# EAGLE design powerbutton (EAGLE 7.1.0)
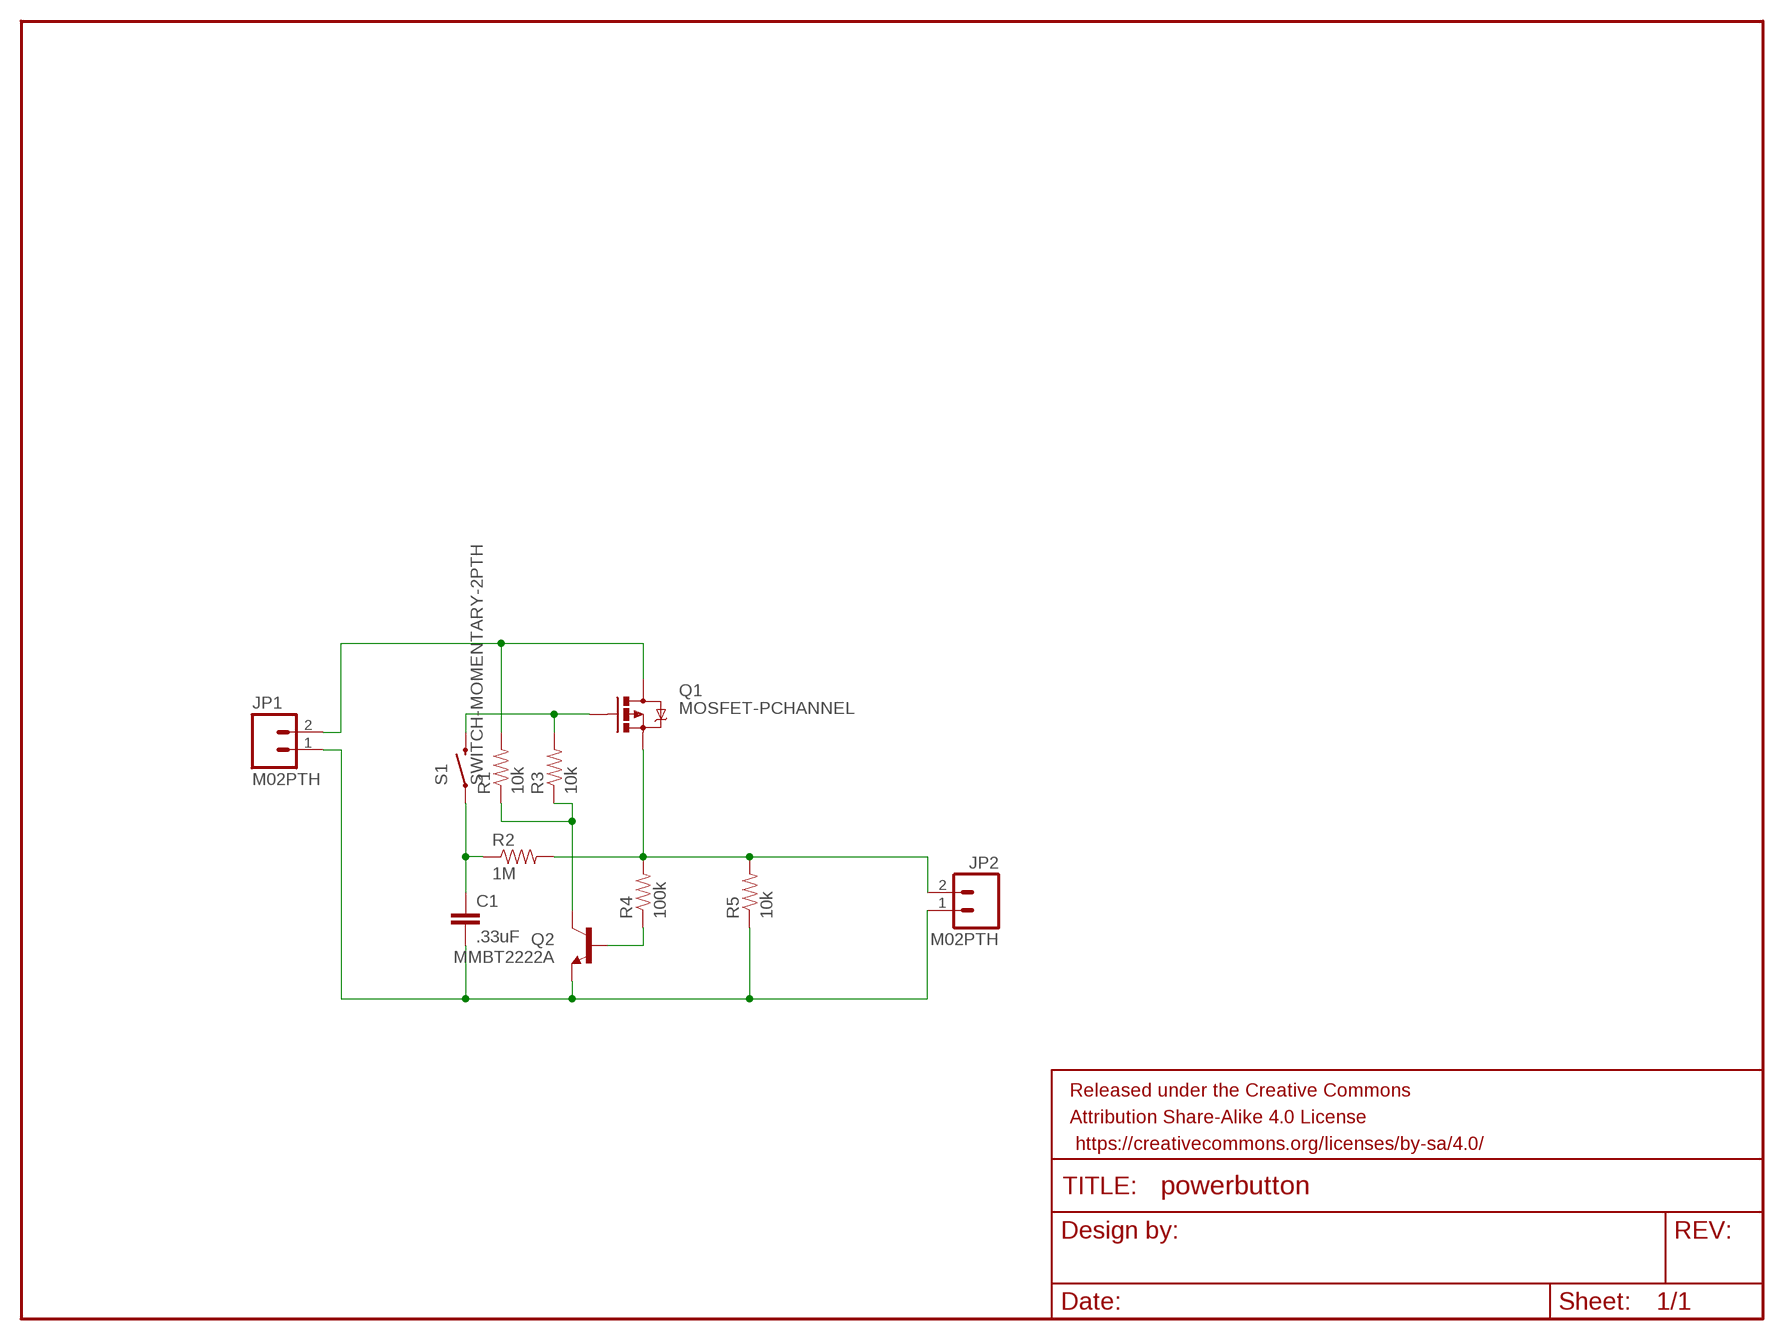
[diagram p0: schematic, sheet 1]

## Parts
C1  .33uF  CAP0603-CAP  [0603-CAP]
FRAME1  FRAME-LETTER  [CREATIVE_COMMONS]
JP1  M02PTH  [1X02]
JP2  M02PTH  [1X02]
Q1  MOSFET-PCHANNEL  [SOT23-3]
Q2  MMBT2222A  TRANSISTOR_NPNMMBT2222A  [SOT23-3]
R1  10k  RESISTOR0603-RES  [0603-RES]
R2  1M  RESISTOR0603-RES  [0603-RES]
R3  10k  RESISTOR0603-RES  [0603-RES]
R4  100k  RESISTOR0603-RES  [0603-RES]
R5  10k  RESISTOR0603-RES  [0603-RES]
S1  SWITCH-MOMENTARY-2PTH  [TACTILE-PTH]

## Nets
N$1: Q1.1(G) R3.2 S1.3
N$2: JP2.2 Q1.2(S) R2.2 R4.2 R5.2
N$3: Q2.1(B) R4.1
N$4: C1.1 R2.1 S1.1
N$5: JP1.2 Q1.3(D) R1.2
N$6: Q2.3(C) R1.1 R3.1
N$8: C1.2 JP1.1 JP2.1 Q2.2(E) R5.1

## Library data of the parts
C1 = SparkFun-Passives:CAP: Capacitor Standard 0603 ceramic capacitor, and 0.1" leaded capacitor.
FRAME1 = SparkFun-Aesthetics:FRAME-LETTER: Schematic Frame Standard 8.5x11 US Letter frame
JP1 JP2 = SparkFun-Connectors:M02: Standard 2-pin 0.1" header. Use with - straight break away headers ( PRT-00116) - right angle break away headers (PRT-00553) - swiss pins (PRT-00743) - machine pins (PRT-00117) - female headers (PRT-00115) Molex polarized connector foot print use with: PRT-08233 with associated crimp pins and housings. 2.54_SCREWTERM for use with PRT-10571. 3.5mm Screw Terminal footprints for PRT-08084 5mm Screw Terminal footprints for use with PRT-08432
Q1 = SparkFun-DiscreteSemi:MOSFET-PCHANNEL: Generic PMOSFET IRLML2244 - TRANS-11153 (SOT-23 -20V -4.3A) (1.Gate 2.Source 3.Drain) FQP27P06 - COM-10349 <http://www.sparkfun.com/products/10349> (TO-220 -60V -27A) (1.Gate 2.Source 3.Drain); PROD_ID: TRANS-08285
Q2 = SparkFun-DiscreteSemi:TRANSISTOR_NPN: Generic NPN BJT MMBT2222A - TRANS-08049 (SOT-23, 1A 40V) MPSA42 - TRANS-09116 (SOT-23, 500mA 300V) MMBT5088LT1G - TRANS-11160 (SOT-23, 50 mA 30V) BC547 - COM-08928 <http://www.sparkfun.com/products/8928> (TO-92 45V 100mA) (1.Collector 2.Base 3.Emitter) 2N3904 - COM-00521 <http://www.sparkfun.com/products/521> (TO-92 40V 200mA) (1.Emitter 2.Base 3.Collector) P2N2222A - COM-12852 <http://www.sparkfun.com/products/12852> (TO-92 40V 600mA) (1.Collector 2.Base 3.Emitter); PROD_ID: TRANS-08049
R1-R5 = SparkFun-Passives:RESISTOR: Resistor Basic schematic elements and footprints for 0603, 1206, and PTH resistors.
S1 = SparkFun-Electromechanical:SWITCH-MOMENTARY-2: Various NO switches- pushbuttons, reed, etc

## Board
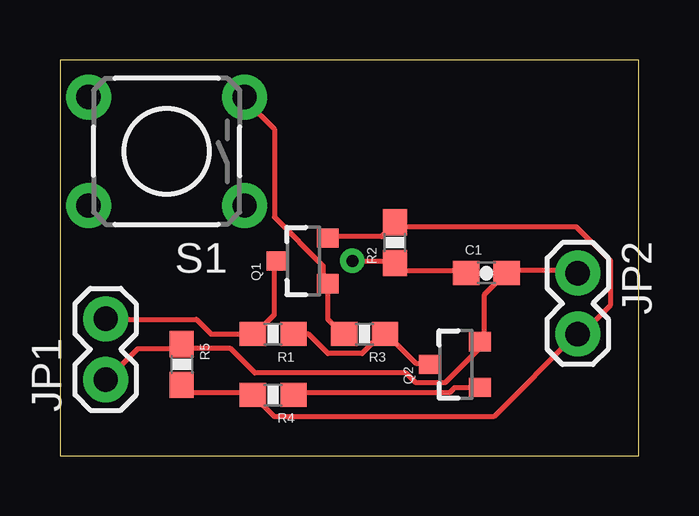
[diagram p1: board, top side]
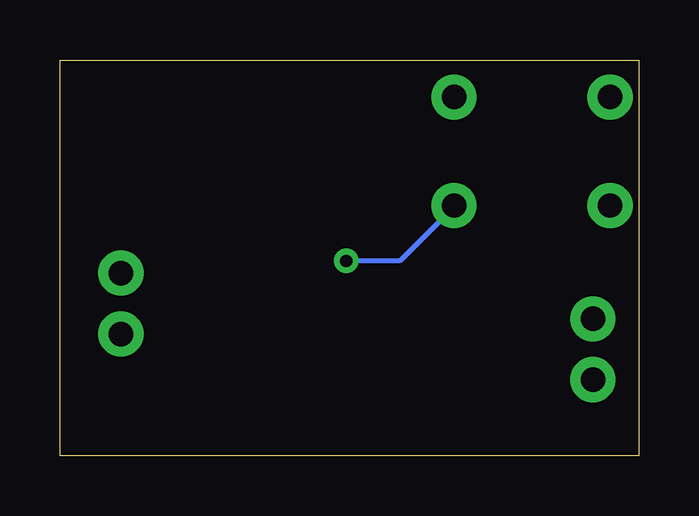
[diagram p2: board, bottom side, seen from below]

Size 24.13 x 16.51 mm. Coordinates in mm from the lower left corner, seen from the top.
Outline: 0,0 24.13,0 24.13,16.51 0,16.51 0,0
Copper layers (1*16): Top 0.035mm / dielectric 1.5mm / Bottom 0.035mm
Design rules "SparkFun": minimum track width 8mil, minimum drill 20mil, track to track 8mil, track to pad 8mil, pad to pad 8mil, via to via 8mil, smd to smd 8mil, copper to edge 10mil, drill to drill 8mil, minimum pad ring 12mil, minimum via ring 10mil, stop-mask expansion 4mil, vias tented up to drill 25mil, thermal gap 10mil

### Footprints (pad centres in the part's own frame; a part is rotated, then mirrored left to right if it is on the bottom)
0603-CAP = smd 1.1 x 1: 1 -0.85,0; 2 0.85,0
1X02 = drill 1.016 pad 1.88: 1 0,0; 2 2.54,0
SOT23-3 = smd 0.8 x 0.9: 1 -0.95,-1; 2 0.95,-1; 3 0,1.1
0603-RES = smd 1.1 x 1: 1 -0.85,0; 2 0.85,0
TACTILE-PTH = drill 1.016 pad 1.88: 1 -3.251,2.261; 2 3.251,2.261; 3 -3.251,-2.261; 4 3.251,-2.261

### Placement (x,y rotation side)
C1  17.78,7.62 0 top
FRAME1  29.21,-8.89 0 top  (outside the outline)
JP1  1.91,3.17 90 top
JP2  21.59,7.62 270 top
Q1  10.16,8.13 90 top
Q2  16.51,3.81 90 top
R1  8.89,5.08 180 top
R2  13.97,8.89 90 top
R3  12.7,5.08 180 top
R4  8.89,2.54 180 top
R5  5.08,3.81 270 top
S1  4.45,12.7 180 top

### Tracks (layer width: path | path; a pad name or v marks a point on that pad's centre or on a via)
N$1
  Top 0.203: R3.2 11.79,5.08 11.18,5.69 11.18,7.11 Q1.1 10.97,7.32 10.97,7.92 8.94,9.96 8.94,13.61 7.72,14.83 S1.3
N$2
  Top 0.203: R5.2 5.08,2.85 5.28,2.64 7.92,2.64 R4.2 8.13,2.44 8.94,1.63 18.09,1.63 21.54,5.08 JP2.2 21.74,5.08 22.96,6.3 22.96,8.13 21.54,9.55 14.02,9.55 R2.2 13.82,9.55 13.41,9.14 11.18,9.14 Q1.2
N$3
  Top 0.203: Q2.1 17.48,2.85 16.46,2.85 16.26,2.64 9.75,2.64 R4.1
N$4  (via drill 0.51)
  Top 0.203: C1.1 16.87,7.72 14.22,7.72 14.02,7.92 R2.1 13.82,8.13 v12.19,8.13
  Bottom 0.203: v12.19,8.13 9.96,8.13 7.72,10.36 S1.1
N$5
  Top 0.203: Q1.3 8.94,8.13 8.94,5.89 8.13,5.08 R1.2 6.3,5.08 5.69,5.69 2.03,5.69 JP1.2
N$6
  Top 0.203: Q2.3 15.24,3.86 14.83,3.86 13.61,5.08 R3.1 13.41,5.08 12.6,4.27 11.18,4.27 10.36,5.08 R1.1
N$8
  Top 0.203: 5.08,4.47 3.25,4.47 2.03,3.25 JP1.1 | JP2.1 21.54,7.72 18.69,7.72 C1.2 18.49,7.52 17.68,6.71 17.68,4.88 Q2.2 17.68,4.67 16.05,3.05 14.83,3.05 14.43,3.45 8.13,3.45 7.11,4.47 5.08,4.47 | 5.08,4.47 R5.1